# Altium schematic sheet EU_Power_Management.SchDoc
size A4; SheetNumber: 4; SheetTotal: 6
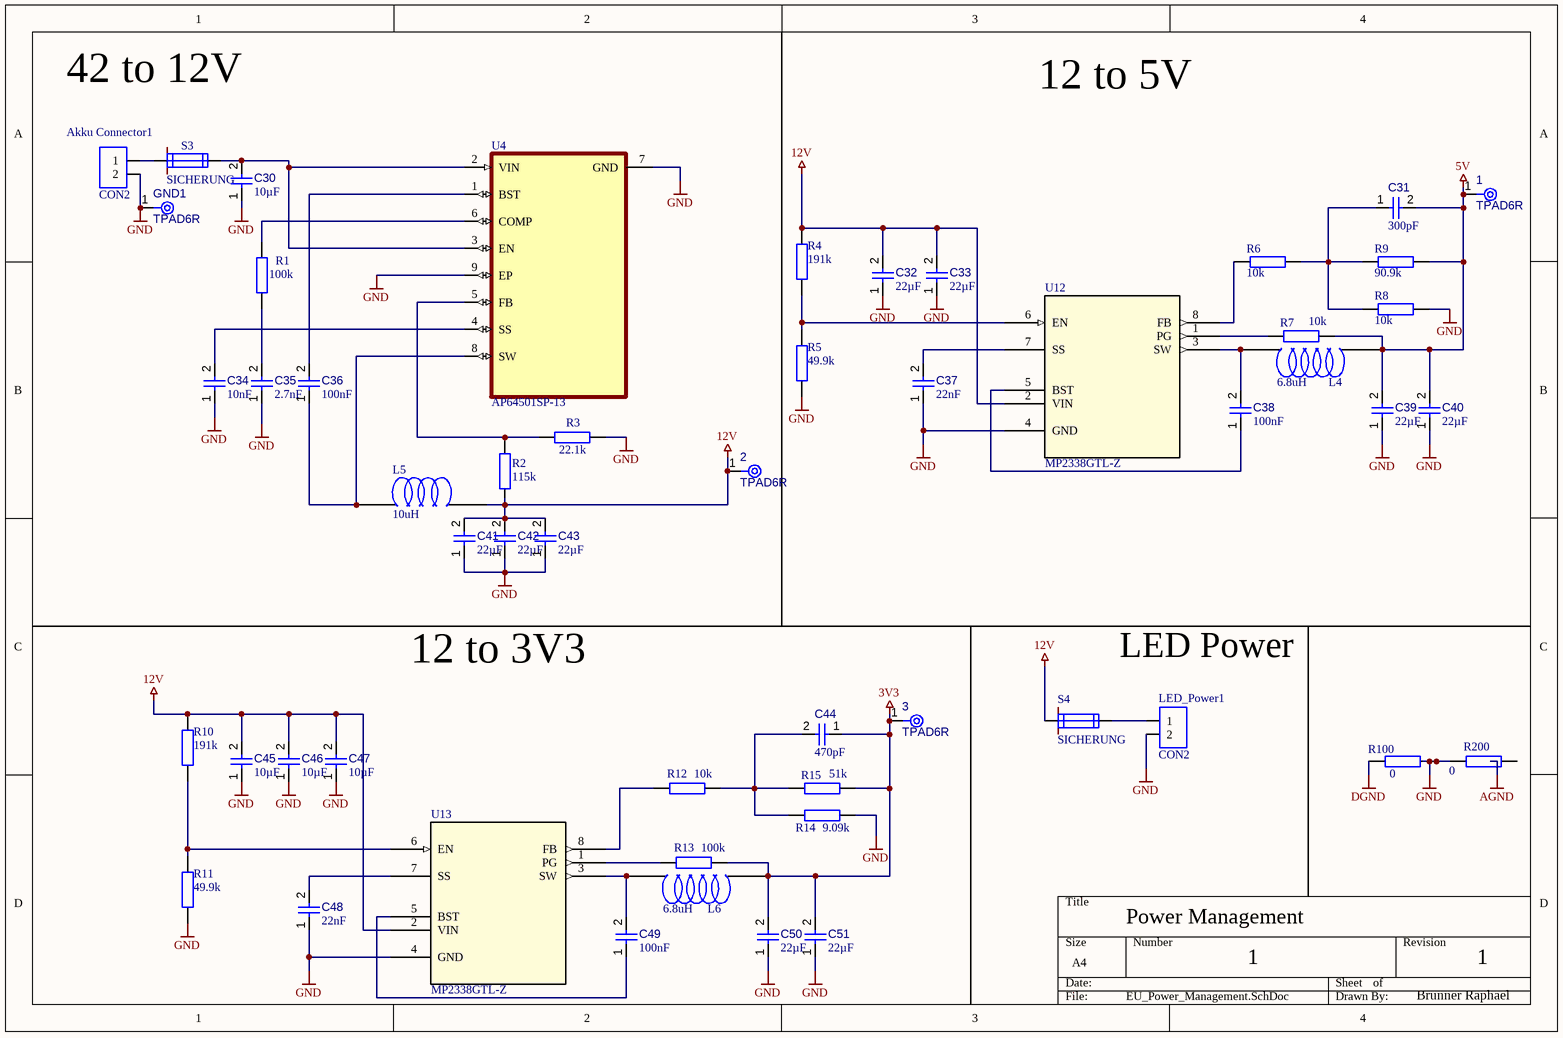
[diagram p0: EU_Power_Management.SchDoc]

## Parts
1  TPAD6R  [TP06R]  (no BOM)
2  TPAD6R  [TP06R]  (no BOM)
3  TPAD6R  [TP06R]  (no BOM)
Akku_Connector1  CON2  [SIP-2]
C30  value 10µF  [CAPC0603(1608)100_L]  (hidden comment: Capacitor 10µF +/-20% 10V 0603)
C31  value 300pF  [CAPC1608X90X40NL10T20]  (hidden comment: Capacitor 100 nF +/-10% 50 V 0603)
C32  value 22µF  [CAPC0805(2012)145_L]  (hidden comment: Capacitor 22µF +/-40% 16V 0805)
C33  value 22µF  [CAPC0805(2012)145_L]  (hidden comment: Capacitor 22µF +/-40% 16V 0805)
C34  10nF  [CAPC1608X94X35NL15T15]
C35  2.7nF  [CAPC1608X94X35NL15T15]
C36  value 100nF  [CAPC1608X94X35NL15T15]  (hidden comment: 0.1uF)
C37  value 22nF  [CAPC0402(1005)60_L]  (hidden comment: Capacitor 22nF +/-20% 10V 0402)
C38  value 100nF  [CAPC1608X90X40NL10T20]  (hidden comment: Capacitor 100 nF +/-10% 50 V 0603)
C39  value 22µF  [CAPC0805(2012)145_L]  (hidden comment: Capacitor 22µF +/-40% 16V 0805)
C40  value 22µF  [CAPC0805(2012)145_L]  (hidden comment: Capacitor 22µF +/-40% 16V 0805)
C41  value 22µF  [CAPC0805(2012)145_L]  (hidden comment: Capacitor 22µF +/-40% 16V 0805)
C42  value 22µF  [CAPC0805(2012)145_L]  (hidden comment: Capacitor 22µF +/-40% 16V 0805)
C43  value 22µF  [CAPC0805(2012)145_L]  (hidden comment: Capacitor 22µF +/-40% 16V 0805)
C44  value 470pF  [CAPC1608X90X40NL10T20]  (hidden comment: Capacitor 100 nF +/-10% 50 V 0603)
C45  value 10µF  [CAPC0603(1608)100_L]  (hidden comment: Capacitor 10µF +/-20% 10V 0603)
C46  value 10µF  [CAPC0603(1608)100_L]  (hidden comment: Capacitor 10µF +/-20% 10V 0603)
C47  value 10µF  [CAPC0603(1608)100_L]  (hidden comment: Capacitor 10µF +/-20% 10V 0603)
C48  value 22nF  [CAPC1608X90X40NL10T20]  (hidden comment: Capacitor 100 nF +/-10% 50 V 0603)
C49  value 100nF  [CAPC1608X90X40NL10T20]  (hidden comment: Capacitor 100 nF +/-10% 50 V 0603)
C50  value 22µF  [CAPC0805(2012)145_L]  (hidden comment: Capacitor 22µF +/-40% 16V 0805)
C51  value 22µF  [CAPC0805(2012)145_L]  (hidden comment: Capacitor 22µF +/-40% 16V 0805)
GND1  TPAD6R  [TP06R]  (no BOM)
L4  6.8uH  [MPL-AL6060]
L5  10uH  [MPL-AY1050]
L6  6.8uH  [MPL-AL6060]
LED_Power1  CON2  [SIP-2]
R1  value 100k  [Axial-0.4]  (hidden comment: RES)
R2  value 115k  [Axial-0.4]  (hidden comment: RES)
R3  value 22.1k  [Axial-0.4]  (hidden comment: RES)
R4  value 191k  [Axial-0.4]  (hidden comment: RES)
R5  value 49.9k  [Axial-0.4]  (hidden comment: RES)
R6  value 10k  [Axial-0.4]  (hidden comment: RES)
R7  value 10k  [Axial-0.4]  (hidden comment: RES)
R8  value 10k  [Axial-0.4]  (hidden comment: RES)
R9  value 90.9k  [Axial-0.4]  (hidden comment: RES)
R10  value 191k  [Axial-0.4]  (hidden comment: RES)
R11  value 49.9k  [Axial-0.4]  (hidden comment: RES)
R12  value 10k  [Axial-0.4]  (hidden comment: RES)
R13  value 100k  [Axial-0.4]  (hidden comment: RES)
R14  value 9.09k  [Axial-0.4]  (hidden comment: RES)
R15  value 51k  [Axial-0.4]  (hidden comment: RES)
R100  value 0  [Axial-0.4]  (hidden comment: RES)
R200  value 0  [Axial-0.4]  (hidden comment: RES)
S3  SICHERUNG  [SICHERUNG]
S4  SICHERUNG  [SICHERUNG]
U4  AP64501SP-13  [SOIC127P600X170-9N]
U12  MP2338GTL-Z  [SOT583_MP2338_MNP]
U13  MP2338GTL-Z  [SOT583_MP2338_MNP]

## Nets
3V3: 3.1(TP) C44.1 C50.2 C51.2 L6.2 R13.2 R15.2
5V: 1.1(TP) C31.2 C39.2 C40.2 L4.2 R7.1 R9.1
12V: 2.1(TP) C32.2 C33.2 C41.2 C42.2 C43.2 C45.2 C46.2 C47.2 L5.2 R2.2 R4.2 R10.1 S4.1 U12.2(VIN) U13.2(VIN)
DGND: R100.1
GND: Akku_Connector1.2 C30.1 C32.1 C33.1 C34.1 C35.1 C37.1 C39.1 C40.1 C41.1 C42.1 C43.1 C45.1 C46.1 C47.1 C48.1 C50.1 C51.1 GND1.1(TP) LED_Power1.2 R3.2 R5.1 R8.1 R11.2 R14.2 R100.2 R200.1 U4.7(GND) U4.9(EP) U12.4(GND) U13.4(GND)
NetAkku_Connector1_1: Akku_Connector1.1 S3.1
NetC30_2: C30.2 S3.2 U4.2(VIN) U4.3(EN)
NetC31_1: C31.1 R6.1 R8.2 R9.2
NetC34_2: C34.2 U4.4(SS)
NetC35_2: C35.2 R1.2
NetC36_1: C36.1 L5.1 U4.8(SW)
NetC36_2: C36.2 U4.1(BST)
NetC37_2: C37.2 U12.7(SS)
NetC38_1: C38.1 U12.5(BST)
NetC38_2: C38.2 L4.1 U12.3(SW)
NetC44_2: C44.2 R12.2 R14.1 R15.1
NetC48_2: C48.2 U13.7(SS)
NetC49_1: C49.1 U13.5(BST)
NetC49_2: C49.2 L6.1 U13.3(SW)
NetLED_Power1_1: LED_Power1.1 S4.2
NetR1_1: R1.1 U4.6(COMP)
NetR2_1: R2.1 R3.1 U4.5(FB)
NetR4_1: R4.1 R5.2 U12.6(EN)
NetR6_2: R6.2 U12.8(FB)
NetR7_2: R7.2 U12.1(PG)
NetR10_2: R10.2 R11.1 U13.6(EN)
NetR12_1: R12.1 U13.8(FB)
NetR13_1: R13.1 U13.1(PG)

Not connected (* = marked no-connect by the designer): R200 2

## Notes on the sheet
- 42 to 12V
- 12 to 5V
- 12 to 3V3
- LED Power
- Power Management
- 1
- Brunner Raphael

## Library data of the parts
1-3 GND1 = CMP-00028-00002-2: 0.6mm round; Pins: 1
Akku_Connector1 LED_Power1 = CON2: Stecker
C30 C45-C47 = CMP-001-00075-4: Chip Capacitor, 10µF +/-20%, 10V, 0603, Thickness 1 mm; Tolerance: 10%; Voltage Rating: 10V; Max Operating Temperature: 85°C; Pins: 2; Case/Package: 0603; Mounting Technology: SMT; Min Operating Temperature: -55°C
C31 C38 C44 C48 C49 = CMP-001-00017-6: Chip Capacitor, 100 nF, +/- 10%, 50 V, 0603 (1608 Metric); Voltage Rating: 50V; Capacitor Type: Ceramic; Tolerance: 10%; Mounting Technology: SM; Max Operating Temperature: 125°C; RoHS Compliant: True; Pins: 2; Case/Package: 0603; Min Operating Temperature: -55°C
C32 C33 C39-C43 C50 C51 = CMP-001-00081-4: Chip Capacitor, 22µF +/-40%, 16V, 0805, Thickness 1.45 mm; Tolerance: 5%; Voltage Rating: 16V; Mounting Technology: SMT; Pins: 2; Max Operating Temperature: 85°C; Case/Package: 0805; Min Operating Temperature: -55°C
C34-C36 = CMP-001-00003-6: Chip Capacitor, 1 uF, +/- 10%, 16 V, 0603 (1608 Metric); Voltage Rating: 16V; Capacitor Type: Ceramic; Max Operating Temperature: 125°C; Pins: 2; Tolerance: 10%; Min Operating Temperature: -55°C; RoHS Compliant: True; Mounting Technology: SM; Case/Package: 0603
  C34: Value: 10nF
  C35: Value: 2.7nF
C37 = CMP-001-00062-3: Chip Capacitor, 22nF +/-20%, 10V, 0402, Thickness 0.6 mm; Tolerance: 10%; Min Operating Temperature: -55°C; Case/Package: 0402; Pins: 2; Max Operating Temperature: 85°C; Mounting Technology: SMT; Voltage Rating: 10V
L4-L6 = Component_1
R1-R15 R100 R200 = RES: Widerstand
S3 S4 = SICHERUNG: Text Field1: Strom
U4 = AP64501SP-13: MF: {'manufacturer': u'Diodes Incorporated'}; Package: None; Price: None; Value: *; MP: AP64501SP-13; Availability: Unavailable
U12 U13 = MP2338GTL-Z: High-Efficiency 28V 3A 450kHz Synchronous Step-Down Converter In SOT583 Package; Manufacturer_Name: Monolithic Power Systems; Copyright: Copyright (C) 2025 Ultra Librarian. All rights reserved.; Manufacturer_Part_Number: MP2338GTL-Z; Datasheet: https://www.monolithicpower.com/en/documentview/productdocument/index/version/2/document_type/Datasheet/lang/en/sku/MP2338GTL; RefDes: RefDes; Type: Type